# EAGLE design raspberrypi-testcard (EAGLE 7.5.0)

## Sheet 1 of 2
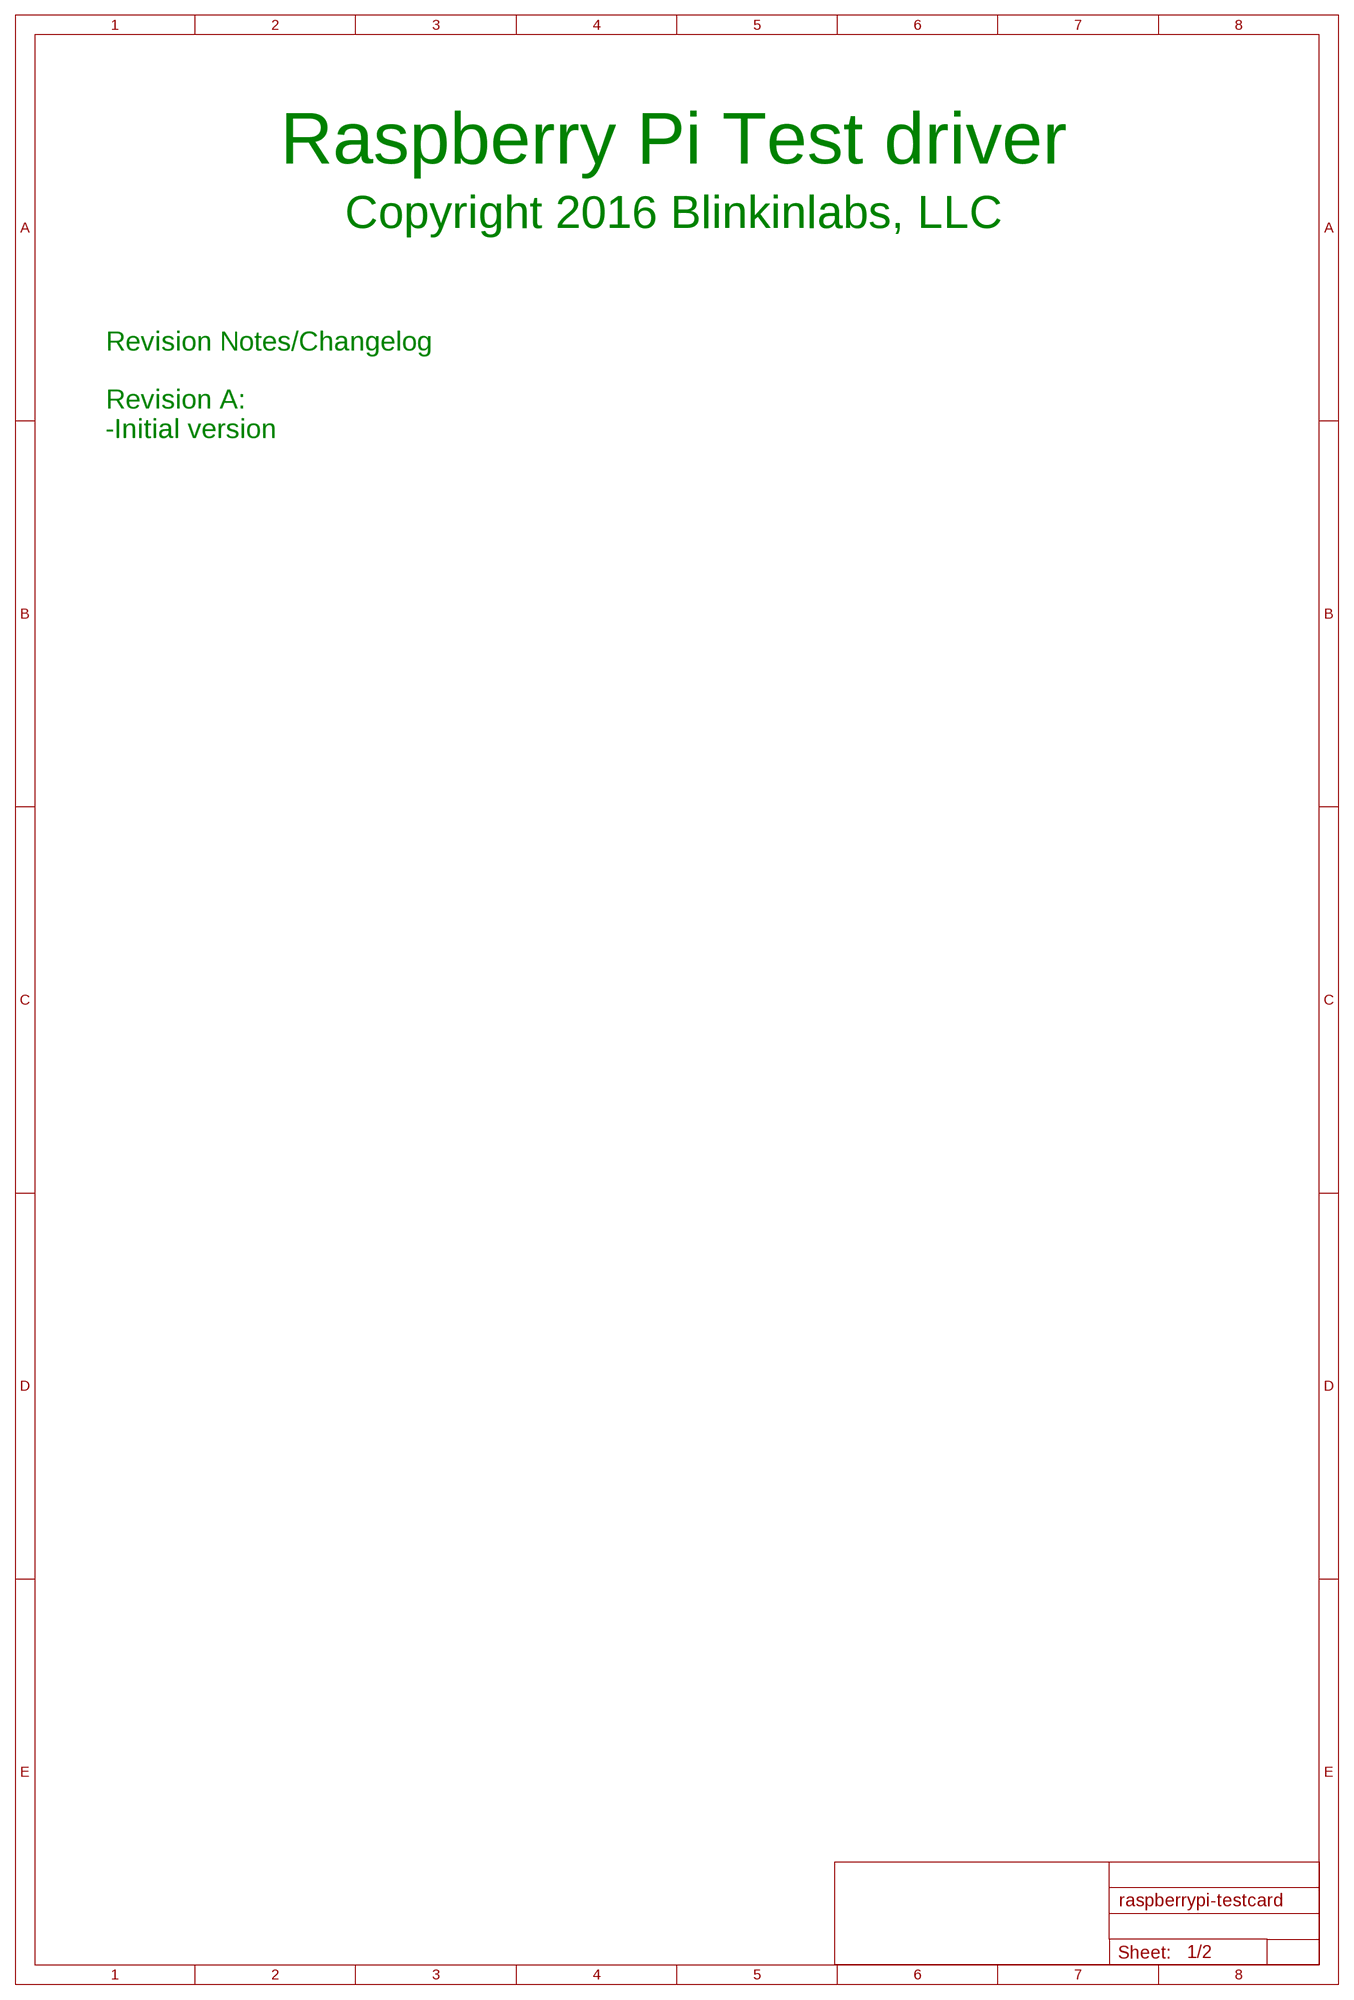
[diagram p0: schematic, sheet 1]

### Notes on the sheet
- Raspberry Pi Test driver
- Copyright 2016 Blinkinlabs, LLC
- Revision Notes/Changelog
  
  Revision A:
  -Initial version

## Sheet 2 of 2
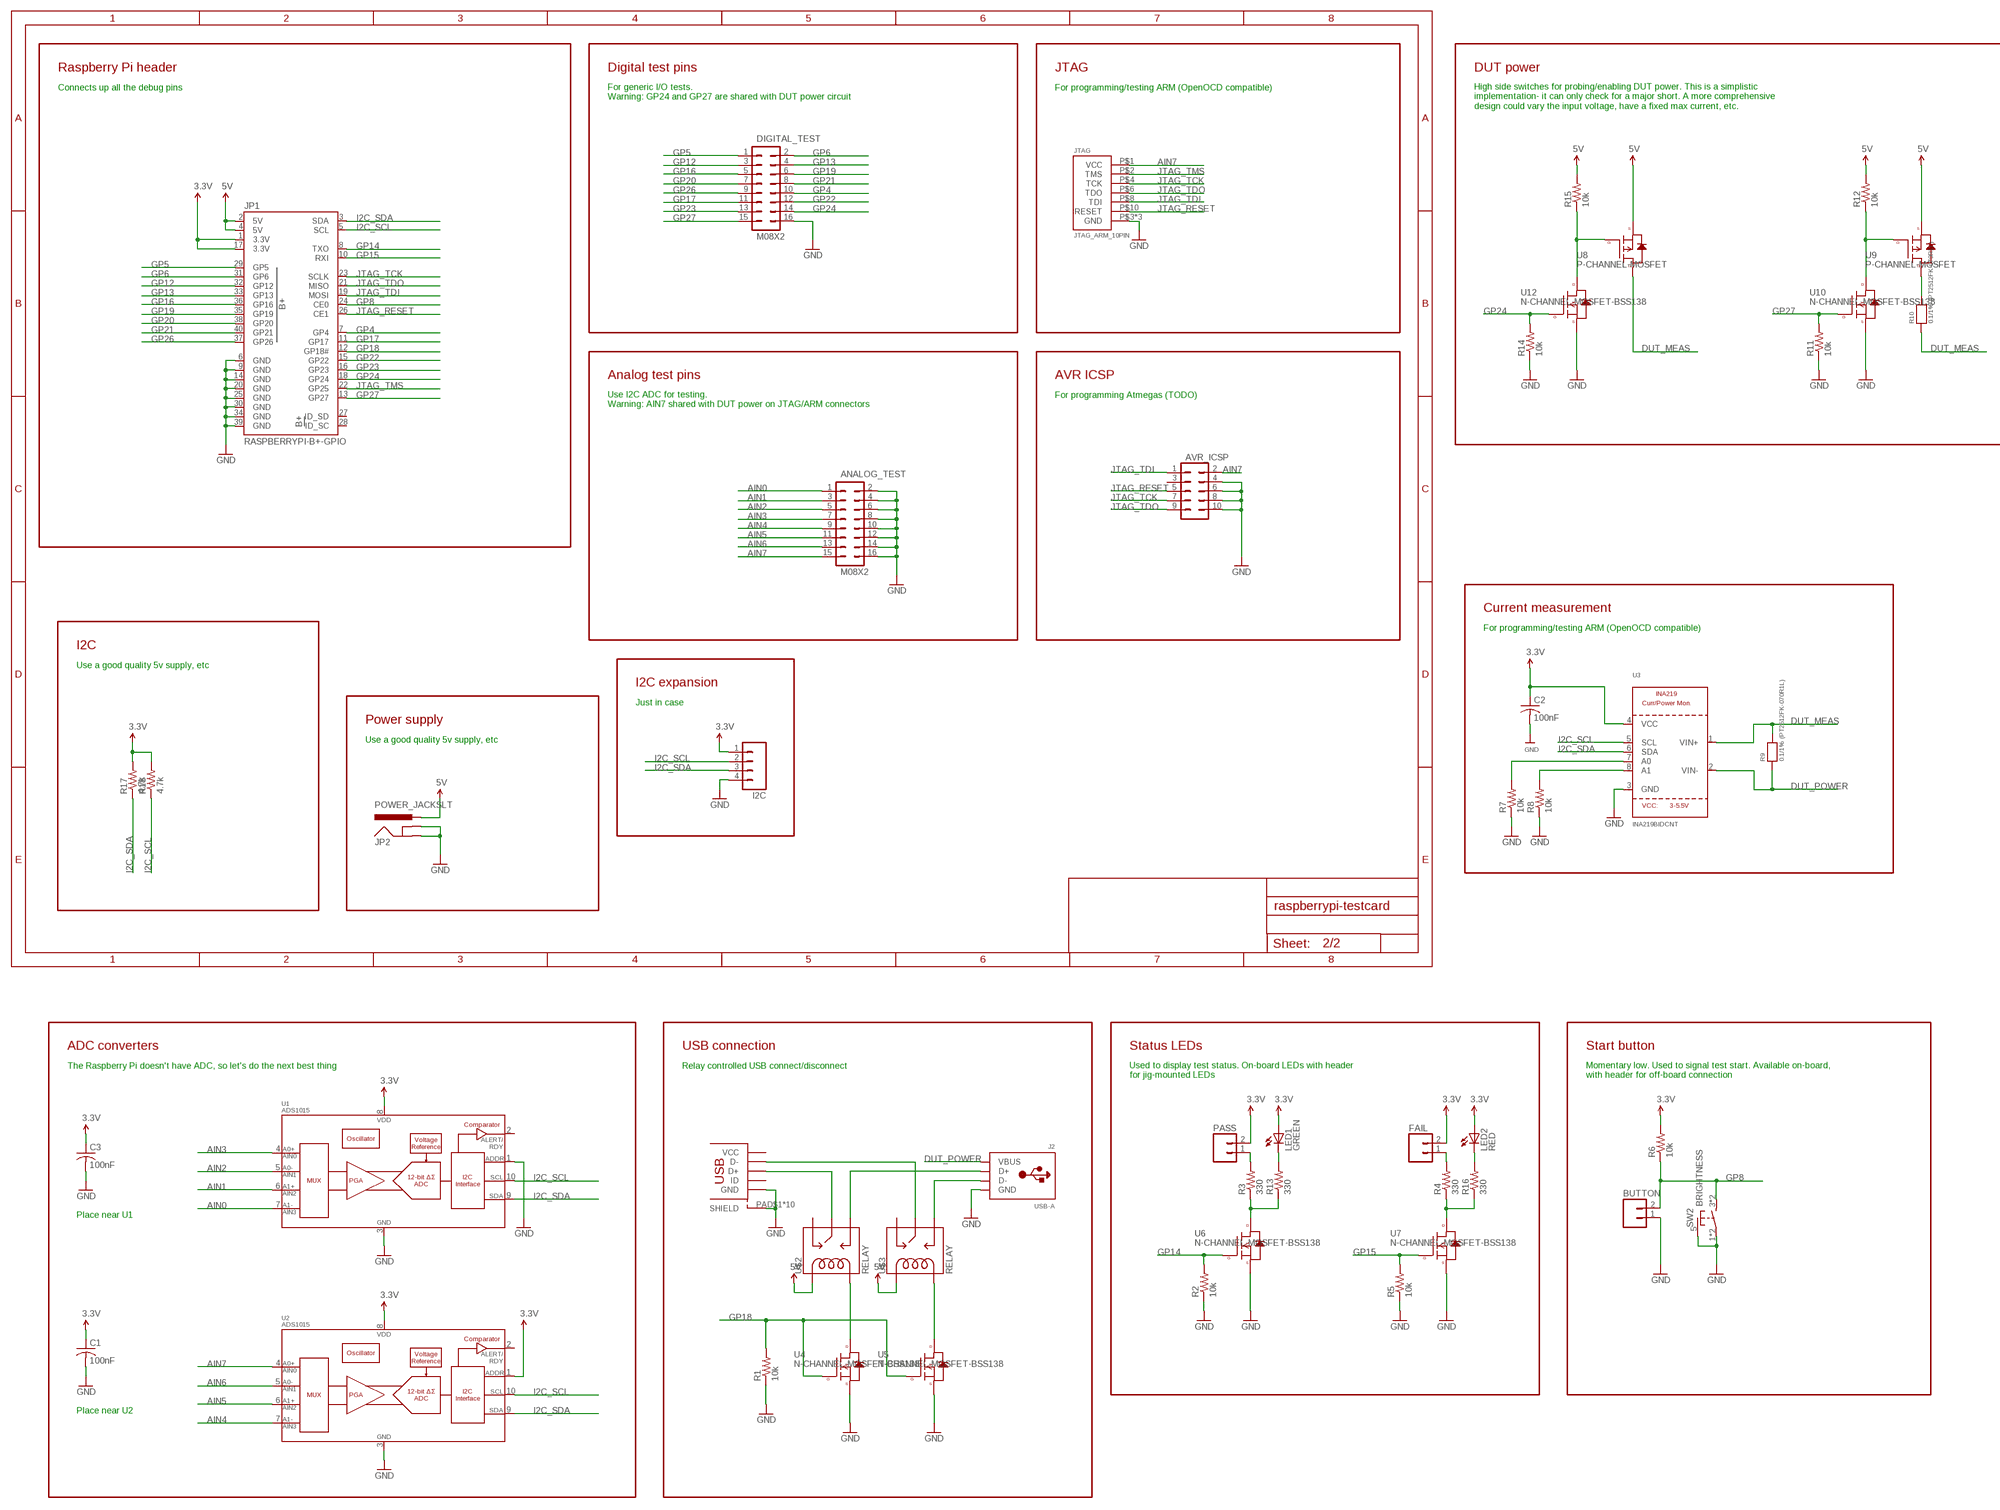
[diagram p1: schematic, sheet 2, part 1 of 2]
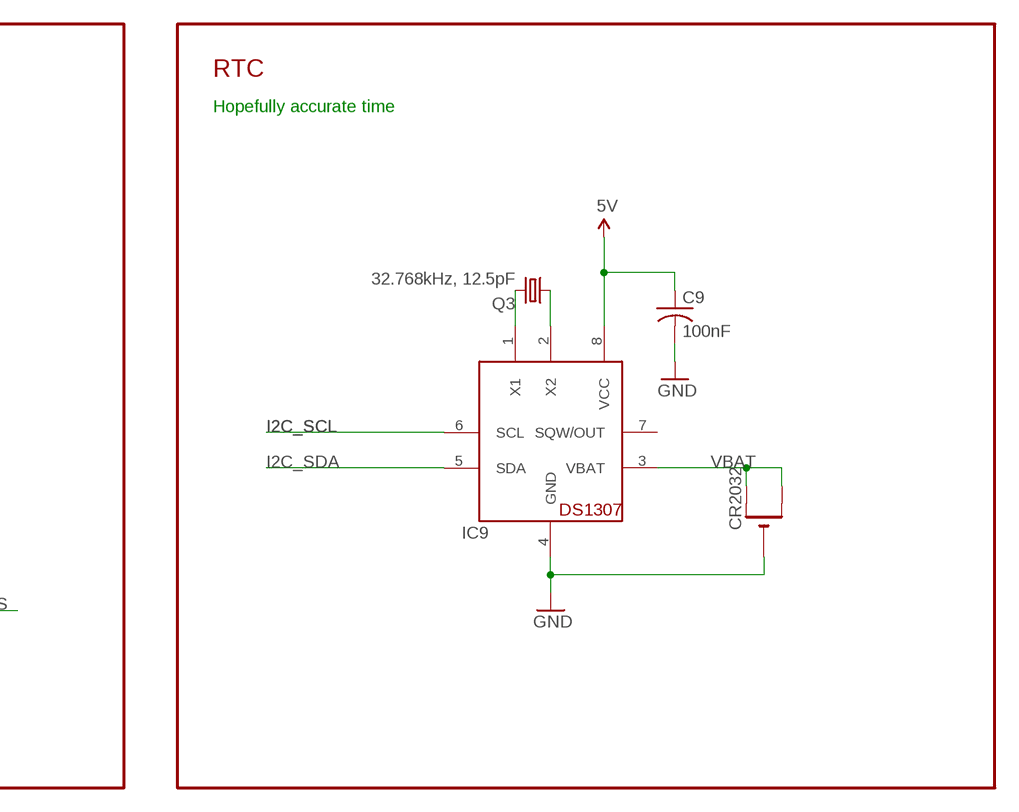
[diagram p2: schematic, sheet 2, part 2 of 2]

### Parts
ANALOG_TEST  M08X2  [2X8]
AVR_ICSP  M05X2PTH  [AVR_ICSP]
BUTTON  M02JST-PTH-2  [JST-2-PTH]
C1  100nF  C-USC0402  [C0402]
C2  100nF  C-USC0402  [C0402]
C3  100nF  C-USC0402  [C0402]
C9  100nF  C-USC0402K  [C0402K]
CR2032  CR2032SMT  [CR2032-SMD]
DIGITAL_TEST  M08X2  [2X8]
FAIL  M02JST-PTH-2  [JST-2-PTH]
I2C  M04PTH  [1X04]
IC9  DS1307SO08  [SO08-150]
J1  USB_MICROSMT+THRUHULE  [USB_MICRO_THRUHOLE]
J2  USB-A  [MOLEX_480371000]
JP1  RASPBERRYPI-B+-GPIO  [2X20-SHROUDED]
JP2  POWER_JACKSLT  [POWER_JACK_SLOT]
JTAG  JTAG_ARM_10PIN  [2X05-1.27MM-SMD]
LED1  GREEN  LEDCHIP-LED0805  [CHIP-LED0805]
LED2  RED  LEDCHIP-LED0805  [CHIP-LED0805]
PASS  M02JST-PTH-2  [JST-2-PTH]
Q3  32.768kHz, 12.5pF  CRYSTALTC26H  [TC26H]
R1  10k  R-US_R0402  [R0402]
R2  10k  R-US_R0402  [R0402]
R3  330  R-US_R0402  [R0402]
R4  330  R-US_R0402  [R0402]
R5  10k  R-US_R0402  [R0402]
R6  10k  R-US_R0402  [R0402]
R7  10k  R-US_R0402  [R0402]
R8  10k  R-US_R0402  [R0402]
R9  0.1/1% (PT2512FK-070R1L)  RESISTOR2512  [2512]
R10  0.1/1% (PT2512FK-070R1L)  RESISTOR2512  [2512]
R11  10k  R-US_R0402  [R0402]
R12  10k  R-US_R0402  [R0402]
R13  330  R-US_R0402  [R0402]
R14  10k  R-US_R0402  [R0402]
R15  10k  R-US_R0402  [R0402]
R16  330  R-US_R0402  [R0402]
R17  4.7k  R-US_R0402  [R0402]
R18  4.7k  R-US_R0402  [R0402]
SW2  BRIGHTNESS  BUTTON_MOMENTARY_GROUND  [TD-07XB]
U1  ADS1015  [MSOP10]
U2  ADS1015  [MSOP10]
U3  INA219BIDCNT  INA219  [SOT23-8]
U4  N-CHANNEL-MOSFET-BSS138  [SOT23-3]
U5  N-CHANNEL-MOSFET-BSS138  [SOT23-3]
U6  N-CHANNEL-MOSFET-BSS138  [SOT23-3]
U7  N-CHANNEL-MOSFET-BSS138  [SOT23-3]
U8  P-CHANNEL-MOSFET  [SOT23-3]
U9  P-CHANNEL-MOSFET  [SOT23-3]
U10  N-CHANNEL-MOSFET-BSS138  [SOT23-3]
U12  N-CHANNEL-MOSFET-BSS138  [SOT23-3]
U$2  RELAY  [RELAY_HK23F-5V]
U$3  RELAY  [RELAY_HK23F-5V]

### Nets
3.3V [power]: C1.1 C2.1 C3.1 FAIL.2 I2C.1 JP1.1(3.3V) JP1.17(3.3V) LED1.A LED2.A PASS.2 R6.2 R17.2 R18.2 U1.8(VDD) U2.1(ADDR) U2.8(VDD) U3.4(VCC)
5V [power]: C9.1 IC9.8(VCC) JP1.2(5V) JP1.4(5V) JP2.PWR R12.2 R15.2 U8.2(S) U9.2(S) U$2.P$2(COIL1) U$3.P$2(COIL1)
AIN0: ANALOG_TEST.1 U1.7(AIN3)
AIN1: ANALOG_TEST.3 U1.6(AIN2)
AIN2: ANALOG_TEST.5 U1.5(AIN1)
AIN3: ANALOG_TEST.7 U1.4(AIN0)
AIN4: ANALOG_TEST.9 U2.7(AIN3)
AIN5: ANALOG_TEST.11 U2.6(AIN2)
AIN6: ANALOG_TEST.13 U2.5(AIN1)
AIN7: ANALOG_TEST.15 AVR_ICSP.2 JTAG.P$1(VCC) U2.4(AIN0)
DUT_MEAS: R9.2 R10.1 U3.1(VIN+) U8.3(D)
DUT_POWER: J2.1(VBUS) R9.1 U3.2(VIN-)
GND [power]: ANALOG_TEST.2 ANALOG_TEST.4 ANALOG_TEST.6 ANALOG_TEST.8 ANALOG_TEST.10 ANALOG_TEST.12 ANALOG_TEST.14 ANALOG_TEST.16 AVR_ICSP.4 AVR_ICSP.6 AVR_ICSP.8 AVR_ICSP.10 BUTTON.1 C1.2 C2.2 C3.2 C9.2 CR2032.- DIGITAL_TEST.16 I2C.4 IC9.4(GND) J1.PAD$1(SHIELD) J1.PAD$2(SHIELD) J1.PAD$3(SHIELD) J1.PAD$4(SHIELD) J1.PAD$5(SHIELD) J1.PAD$6(SHIELD) J1.PAD$7(SHIELD) J1.PAD$8(SHIELD) J1.PAD$9(SHIELD) J1.PAD$10(SHIELD) J1.PIN$5(GND) J2.4(GND) JP1.6(GND) JP1.9(GND) JP1.14(GND) JP1.20(GND) JP1.25(GND) JP1.30(GND) JP1.34(GND) JP1.39(GND) JP2.GND@1(GNDBREAK) JP2.GND@2(GND) JTAG.P$3(GND) JTAG.P$5(GND) JTAG.P$9(GND) R1.1 R2.1 R5.1 R7.1 R8.1 R11.1 R14.1 SW2.1(P) SW2.2(P) SW2.5(SHIELD) U1.1(ADDR) U1.3(VSS) U2.3(VSS) U3.3(GND) U4.2(S) U5.2(S) U6.2(S) U7.2(S) U10.2(S) U12.2(S)
GP4: DIGITAL_TEST.10 JP1.7(GP4)
GP5: DIGITAL_TEST.1 JP1.29(GP5)
GP6: DIGITAL_TEST.2 JP1.31(GP6)
GP8: BUTTON.2 JP1.24(CE0) R6.1 SW2.3(S) SW2.4(S)
GP12: DIGITAL_TEST.3 JP1.32(GP12)
GP13: DIGITAL_TEST.4 JP1.33(GP13)
GP14: JP1.8(TXO) R2.2 U6.1(G)
GP15: JP1.10(RXI) R5.2 U7.1(G)
GP16: DIGITAL_TEST.5 JP1.36(GP16)
GP17: DIGITAL_TEST.11 JP1.11(GP17)
GP18: JP1.12(GP18#) R1.2 U4.1(G) U5.1(G)
GP19: DIGITAL_TEST.6 JP1.35(GP19)
GP20: DIGITAL_TEST.7 JP1.38(GP20)
GP21: DIGITAL_TEST.8 JP1.40(GP21)
GP22: DIGITAL_TEST.12 JP1.15(GP22)
GP23: DIGITAL_TEST.13 JP1.16(GP23)
GP24: DIGITAL_TEST.14 JP1.18(GP24) R14.2 U12.1(G)
GP26: DIGITAL_TEST.9 JP1.37(GP26)
GP27: DIGITAL_TEST.15 JP1.13(GP27) R11.2 U10.1(G)
I2C_SCL: I2C.2 IC9.6(SCL) JP1.5(SCL) R18.1 U1.10(SCL) U2.10(SCL) U3.5(SCL)
I2C_SDA: I2C.3 IC9.5(SDA) JP1.3(SDA) R17.1 U1.9(SDA) U2.9(SDA) U3.6(SDA)
JTAG_RESET: AVR_ICSP.5 JP1.26(CE1) JTAG.P$10(RESET)
JTAG_TCK: AVR_ICSP.7 JP1.23(SCLK) JTAG.P$4(TCK)
JTAG_TDI: AVR_ICSP.1 JP1.19(MOSI) JTAG.P$8(TDI)
JTAG_TDO: AVR_ICSP.9 JP1.21(MISO) JTAG.P$6(TDO)
JTAG_TMS: JP1.22(GP25) JTAG.P$2(TMS)
N$1: J1.PIN$3(D+) U$2.P$1(MAIN) U$2.P$6(MAIN)
N$2: J2.3(D+) U$2.P$3(NO)
N$3: J1.PIN$2(D-) U$3.P$1(MAIN) U$3.P$6(MAIN)
N$4: J2.2(D-) U$3.P$3(NO)
N$5 [power]: R4.1 R16.1 U7.3(D)
N$6 [power]: U5.3(D) U$3.P$5(COIL2)
N$7 [power]: U4.3(D) U$2.P$5(COIL2)
N$8 [power]: R3.1 R13.1 U6.3(D)
N$9: R8.2 U3.8(A1)
N$10 [power]: FAIL.1 R4.2
N$11 [power]: PASS.1 R3.2
N$12: R7.2 U3.7(A0)
N$13 [power]: R10.2 U9.3(D)
N$14 [power]: R12.1 U9.1(G) U10.3(D)
N$15 [power]: LED2.C R16.2
N$16 [power]: R15.1 U8.1(G) U12.3(D)
N$17 [power]: LED1.C R13.2
N$72 [power]: IC9.1(X1) Q3.2
N$73 [power]: IC9.2(X2) Q3.1
VBAT [power]: CR2032.+$1(+) CR2032.+$2(+1) IC9.3(VBAT)
Unconnected: AVR_ICSP.3 IC9.7(SQW/OUT) J1.PIN$1(VCC) J1.PIN$4(ID) JP1.27(ID_SD) JP1.28(ID_SC) U1.2(ALERT/RDY) U2.2(ALERT/RDY) U$2.P$4(NC) U$3.P$4(NC)

### Notes on the sheet
- Raspberry Pi header | Digital test pins | JTAG | DUT power | RTC
- Connects up all the debug pins | For programming/testing ARM (OpenOCD compatible) | Hopefully accurate time
- For generic I/O tests.
  Warning: GP24 and GP27 are shared with DUT power circuit
- High side switches for probing/enabling DUT power. This is a simplistic
  implementation- it can only check for a major short. A more comprehensive
  design could vary the input voltage, have a fixed max current, etc.
- Analog test pins | AVR ICSP
- For programming Atmegas (TODO)
- Use I2C ADC for testing.
  Warning: AIN7 shared with DUT power on JTAG/ARM connectors
- Current measurement
- For programming/testing ARM (OpenOCD compatible)
- I2C
- Use a good quality 5v supply, etc
- I2C expansion
- Just in case
- Power supply
- Use a good quality 5v supply, etc
- ADC converters | USB connection | Status LEDs | Start button
- The Raspberry Pi doesn't have ADC, so let's do the next best thing | Relay controlled USB connect/disconnect
- Used to display test status. On-board LEDs with header
  for jig-mounted LEDs
- Momentary low. Used to signal test start. Available on-board,
  with header for off-board connection
- Place near U1
- Place near U2

## Library data of the parts
ANALOG_TEST DIGITAL_TEST = SparkFun-Connectors:M08X2: .1" headers, two rows of 8 each
AVR_ICSP = SparkFun-Connectors:M05X2: Header 5x2 Standard 10-pin dual row 0.1" header. Commonly used with AVR-ISP. Use with Spark Fun Electronics SKU: PRT-00778
BUTTON FAIL PASS = SparkFun-Connectors:M02: Standard 2-pin 0.1" header. Use with - straight break away headers ( PRT-00116) - right angle break away headers (PRT-00553) - swiss pins (PRT-00743) - machine pins (PRT-00117) - female headers (PRT-00115) Molex polarized connector foot print use with: PRT-08233 with associated crimp pins and housings. 2.54_SCREWTERM for use with PRT-10571. 3.5mm Screw Terminal footprints for PRT-08084 5mm Screw Terminal footprints for use with PRT-08432; PROD_ID: CONN-09863; SKU: PRT-09914
C1-C3 C9 = adafruit:C-US: CAPACITOR, American symbol
CR2032 = adafruit:CR2032
I2C = SparkFun-Connectors:M04: Header 4 Standard 4-pin 0.1" header. Use with straight break away headers (SKU : PRT-00116), right angle break away headers (PRT-00553), swiss pins (PRT-00743), machine pins (PRT-00117), and female headers (PRT-00115). Molex polarized connector foot print use with SKU : PRT-08231 with associated crimp pins and housings. 1MM SMD Version SKU: PRT-10208
IC9 = blinkinlabs:DS1307: DS1307 Real time clock (RTC) with battery backup ability. Talk to it via i2c
J1 = blinkinlabs:USB_MICRO
J2 = adafruit:USB-A: USB type A 'plug' Used for things that can directly connect to a USB port, say USB key
JP1 = SparkFun-Boards:RASPBERRYPI-B+-GPIO: Raspberry Pi B+ GPIO Header 2x20 pin connector
JP2 = SparkFun-Connectors:POWER_JACK: Power Jack This is the standard 5.5mm barrel jack for power. The PTH is the most common, proven, reliable, footprint. The Slot footprint only works if the mill layer is transmitted to the PCB fab house so be warned. Mating wall wart : TOL-00298 (and others); PROD_ID: PRT-00119
JTAG = blinkinlabs:JTAG_ARM_10PIN
LED1 LED2 = adafruit:LED: LED OSRAM: - CHIPLED LG R971, LG N971, LY N971, LG Q971, LY Q971, LO R971, LY R971 LH N974, LH R974 LS Q976, LO Q976, LY Q976 LO Q996 - Hyper CHIPLED LW Q18S LB Q993, LB Q99A, LB R99A - SideLED LS A670, LO A670, LY A670, LG A670, LP A670 LB A673, LV A673, LT A673, LW A673 LH A674 LY A675 LS A676, LA A676, LO A676, LY A676, LW A676 LS A679, LY A679, LG A679 - Hyper Micro SIDELED® LS Y876, LA Y876, LO Y876, LY Y876 LT Y87S - SmartLED LW L88C, LW L88S LB L89C, LB L89S, LG L890 LS L89K, LO L89K, LY L89K LS L896, LA L896, LO L896, LY L896 - TOPLED LS T670, LO T670, LY T670, LG T670, LP T670 LSG T670, LSP T670, LSY T670, LOP T670, LYG T670 LG T671, LOG T671, LSG T671 LB T673, LV T673, LT T673, LW T673 LH T674 LS T676, LA T676, LO T676, LY T676, LB T676, LH T676, LSB T676, LW T676 LB T67C, LV T67C, LT T67C, LS T67K, LO T67K, LY T67K, LW E67C LS E67B, LA E67B, LO E67B, LY E67B, LB E67C, LV E67C, LT E67C LW T67C LS T679, LY T679, LG T679 LS T770, LO T770, LY T770, LG T770, LP T770 LB T773, LV T773, LT T773, LW T773 LH T774 LS E675, LA E675, LY E675, LS T675 LS T776, LA T776, LO T776, LY T776, LB T776 LHGB T686 LT T68C, LB T68C - Hyper Mini TOPLED® LB M676 - Mini TOPLED Santana® LG M470 LS M47K, LO M47K, LY M47K Source: http://www.osram.convergy.de/
Q3 = adafruit:CRYSTAL: CRYSTAL; OC_FARNELL: unknown; OC_NEWARK: unknown
R1-R8 R11-R18 = adafruit:R-US_: RESISTOR, American symbol
R9 R10 = microbuilder:RESISTOR: Resistors 0402 - 0402 Surface Mount Package 22 Ohm 1% 1/16W [Digikey: 311-22.0LRTR-ND] 33 Ohm 5% 1/16W 1.0K 5% 1/16W 1.5K 5% 1/16W 2.0K 1% 1/16W 10.0K 1% 1/16W [Digikey: 311-10.0KLRTR-ND] 10.0K 5% 1/16W [Digikey: RMCF0402JT10K0TR-ND] 12.1K 1% 1/16W [Digikey: 311-22.0LRTR-ND] 100.0K 5% 1/16W 0603 - 0603 Surface Mount Package 0 Ohm 1/10 Watt 1% Resistor 15 Ohm 1/10 Watt 1% Resistor 33 Ohm 1/10 Watt 1% Resistor 49.9 Ohm 1/10 Watt 1% Resistor 100 Ohm 1/10 Watt 1% Resistor 150 Ohm 1/10 Watt 1% Resistor 240 Ohm 1/10 Watt 1% Resistor 390 Ohm 1/10 Watt 1% Resistor 560 Ohm 1/10 Watt 1% Resistor 680 Ohm 1/10 Watt 1% Resistor 750 Ohm 1/10 Watt 1% Resistor 1.0K Ohm 1/10 Watt 1% Resistor 1.5K Ohm 1/10 Watt 1% Resistor 2.0K Ohm 1/10 Watt 1% Resistor 2.2K Ohm 1/10 Watt 1% Resistor 3.3K Ohm 1/10 Watt 1% Resistor 4.7K Ohm 1/10 Watt 1% Resistor 10.0K Ohm 1/10 Watt 1% Resistor 12.0K Ohm 1/10 Watt 1% Resistor 12.1K Ohm 1/10 Watt 1% Resistor 20.0K Ohm 1/10 Watt 1% Resistor 33.0K Ohm 1/10 Watt 1% Resistor 100.0K Ohm 1/10 Watt 1% Resistor 0805 - 0805 Surface Mount Package 0 Ohm 1/8 Watt 1% Resistor 33 Ohm 1/8 Watt 1% Resistor 100 Ohm 1/8 Watt 1% Resistor 150 Ohm 1/8 Watt 1% Resistor 200 Ohm 1/8 Watt 1% Resistor 240 Ohm 1/8 Watt 1% Resistor 330 Ohm 1/8 Watt 1% Resistor 390 Ohm 1/8 Watt 1% Resistor 470 Ohm 1/8 Watt 1% Resistor 1.0K Ohm 1/8 Watt 1% Resistor 1.5K Ohm 1/8 Watt 1% Resistor 2.0K Ohm 1/8 Watt 1% Resistor 4.7K Ohm 1/8 Watt 1% Resistor 5.1K Ohm 1/8 Watt 1% Resistor 5.6K Ohm 1/8 Watt 1% Resistor 10.0K Ohm 1/8 Watt 1% Resistor 22.0K Ohm 1/8 Watt 1% Resistor 33.0K Ohm 1/8 Watt 1% Resistor 100K Ohm 1/8 Watt 1% Resistor 1206 - 1206 Surface Mount Package 2012 - 2010 Surface Mount Package 0.11 Ohm 1/2 Watt 1% Resistor - Digikey: RHM.11UCT-ND
SW2 = blinkinlabs:BUTTON_MOMENTARY_GROUND
U1 U2 = SparkFun-AnalogIC:ADS1015: 12-Bit Del-Sig ADC Four single-ended inputs or two differential inputs Internal PGA I2C interface 2.0-5.5V; PROD_ID: IC-12239
U3 = microbuilder:INA219: INA219 - I2C Current/Power Monitor Voltage Range: 0-26V Accuracy: 0.5% Temperature: -40°C - 125°C
U4-U7 U10 U12 = GeekAmmo:N-CHANNEL-MOSFET: N-Channel MOSFET Mode Field Effect Transistor; DATASHEET: http://www.fairchildsemi.com/ds/BS/BSS138.pdf; DIGIKEY: BSS138TR-ND; ELEMENT14: 2323154; URL: http://au.element14.com/fairchild-semiconductor/bss138/mosfet-n-ch-50v-220ma-sot-23/dp/2323154
U8 U9 = GeekAmmo:P-CHANNEL-MOSFET: P-Channel MOSFET Mode Field Effect Transistor
U$2 U$3 = blinkinlabs:RELAY

## Net classes
1 power: width 0.254 mm, drill 0.35 mm

## Board
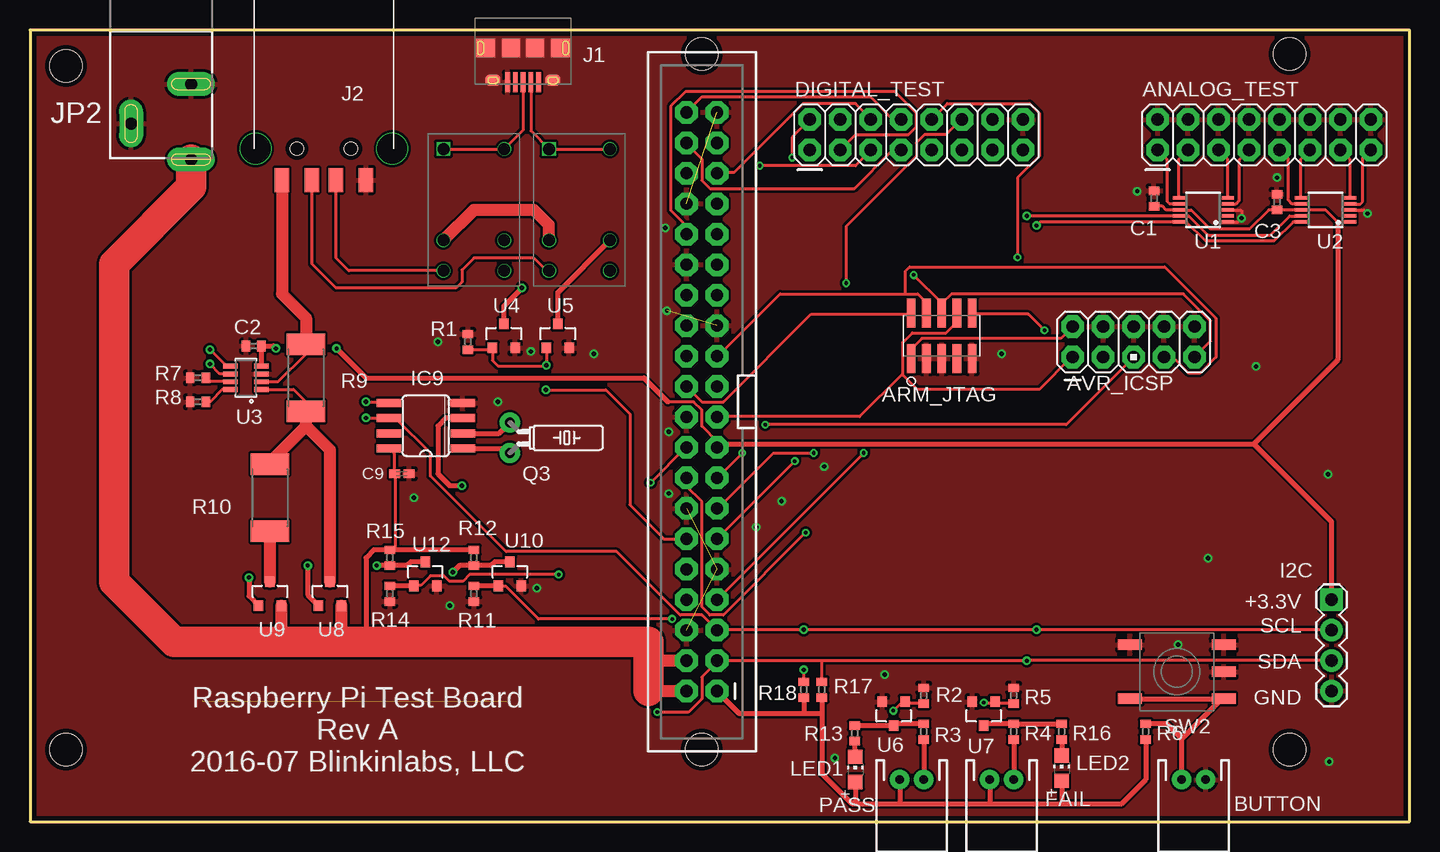
[diagram p3: board, top side]
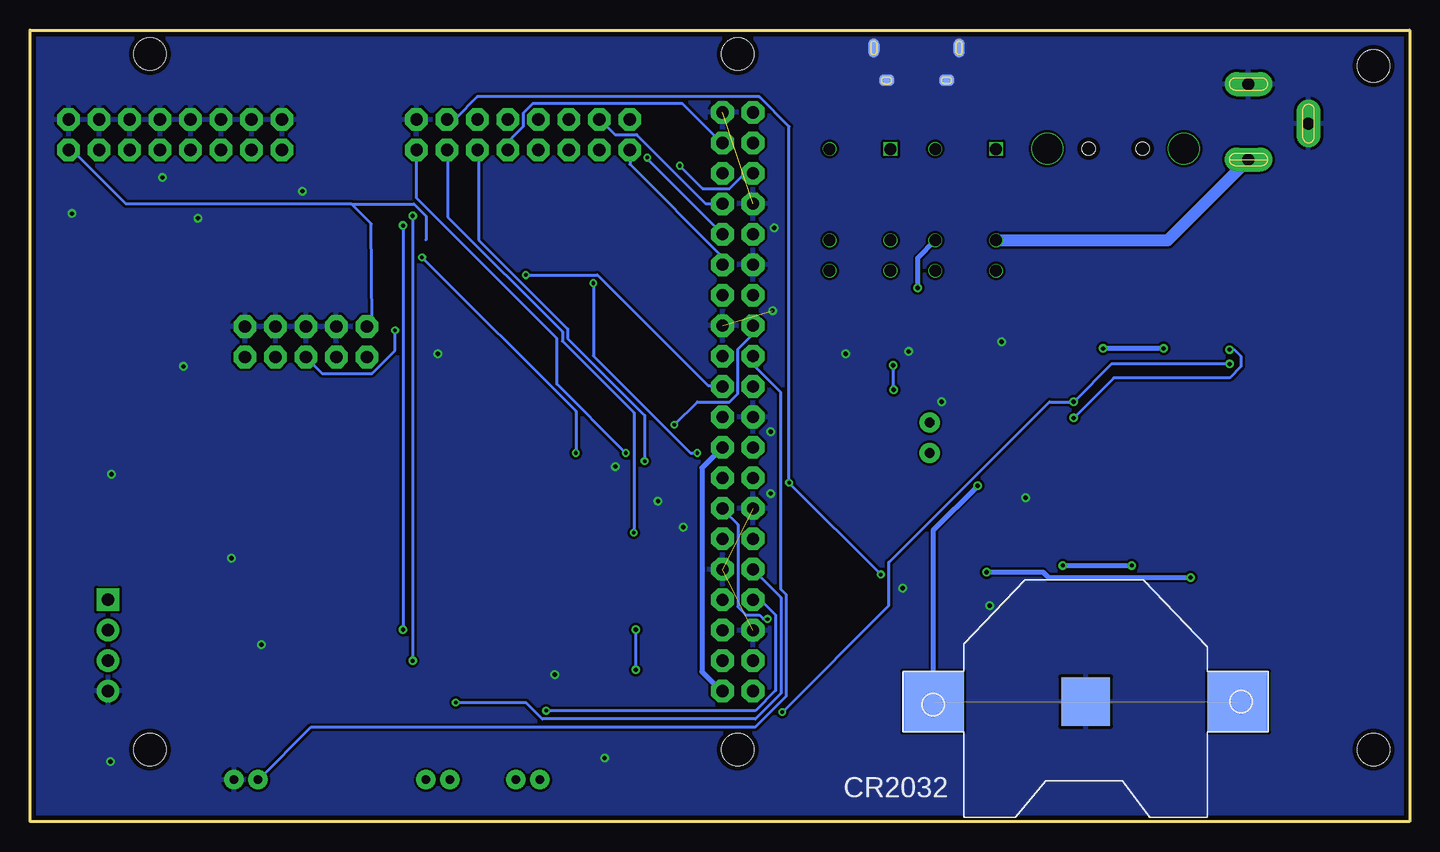
[diagram p4: board, bottom side, seen from below]

Size 115 x 66 mm. Coordinates in mm from the lower left corner, seen from the top.
Outline: 0,66 0,0 115,0 115,66 0,66
Copper layers (1*16): Top 0.0356mm / dielectric 0.6mm / Bottom 0.0356mm
Design rules "BlinkyTape *": minimum track width 0.25mm, minimum drill 0.3mm, track to track 0.2mm, track to pad 0.2mm, pad to pad 0.2mm, via to via 0.2mm, smd to smd 0.2mm, copper to edge 15mil, drill to drill 0.25mm, minimum pad ring 3mil, minimum via ring 7mil, stop-mask expansion 2mil, vias tented up to drill 0.35mm, thermal gap 10mil
Holes 2.7 mm at 56,64 56,6 105,6 105,64 3,63 3,6

### Footprints (pad centres in the part's own frame; a part is rotated, then mirrored left to right if it is on the bottom)
2X8 = drill 1.016 pad 1.88 octagon: 1 0,0; 2 0,2.54; 3 2.54,0; 4 2.54,2.54; 5 5.08,0; 6 5.08,2.54; 7 7.62,0; 8 7.62,2.54; 9 10.16,0; 10 10.16,2.54; 11 12.7,0; 12 12.7,2.54; 13 15.24,0; 14 15.24,2.54; 15 17.78,0; 16 17.78,2.54
AVR_ICSP = drill 1.016 pad 1.88 octagon: 1 -1.27,5.08; 2 1.27,5.08; 3 -1.27,2.54; 4 1.27,2.54; 5 -1.27,0; 6 1.27,0; 7 -1.27,-2.54; 8 1.27,-2.54; 9 -1.27,-5.08; 10 1.27,-5.08
JST-2-PTH = drill 0.7 pad 1.6: 1 -1,0; 2 1,0
C0402 = smd 0.7 x 0.9: 1 -0.65,0; 2 0.65,0
C0402K = smd 0.925 x 0.74: 1 -0.6,0; 2 0.6,0
CR2032-SMD = smd 5.08 x 5.08: +$1 -12.7,0; +$2 12.7,0 | smd 4.064 x 4.064: - 0,0
1X04 = drill 1.016 pad 1.88 square: 1 0,0 | drill 1.016 pad 1.88: 2 2.54,0; 3 5.08,0; 4 7.62,0
SO08-150 = smd 0.66 x 2.032: 1 -1.905,-3.073; 2 -0.635,-3.073; 3 0.635,-3.073; 4 1.905,-3.073; 5 1.905,3.073; 6 0.635,3.073; 7 -0.635,3.073; 8 -1.905,3.073
USB_MICRO_THRUHOLE = smd 1.645 x 1.55: PAD$1 -3.172,0; PAD$4 3.172,0 | smd 1.5 x 1.55: PAD$2 -1,0; PAD$3 1,0 | smd 1.25 x 0.95: PAD$5 -2.5,2.7; PAD$6 2.5,2.7 | smd 0.9 x 1.55 bottom: PAD$7 -3.55,0; PAD$8 3.55,0 | smd 1.25 x 0.95 bottom: PAD$9 -2.5,2.7; PAD$10 2.5,2.7 | smd 0.4 x 1.65: PIN$1 -1.3,2.85; PIN$2 -0.65,2.85; PIN$3 0,2.85; PIN$4 0.65,2.85; PIN$5 1.3,2.85
MOLEX_480371000 = smd 1.2 x 2: 1 3.5,2.6; 2 1,2.6; 3 -1,2.6; 4 -3.5,2.6 | drill 2.5: M1 -5.7,0; M2 5.7,0 | hole 1.1: -2.25,0; 2.25,0
2X20-SHROUDED = drill 1.016 pad 1.88 octagon: 1 -1.27,24.13; 2 1.27,24.13; 3 -1.27,21.59; 4 1.27,21.59; 5 -1.27,19.05; 6 1.27,19.05; 7 -1.27,16.51; 8 1.27,16.51; 9 -1.27,13.97; 10 1.27,13.97; 11 -1.27,11.43; 12 1.27,11.43; 13 -1.27,8.89; 14 1.27,8.89; 15 -1.27,6.35; 16 1.27,6.35; 17 -1.27,3.81; 18 1.27,3.81; 19 -1.27,1.27; 20 1.27,1.27; 21 -1.27,-1.27; 22 1.27,-1.27; 23 -1.27,-3.81; 24 1.27,-3.81; 25 -1.27,-6.35; 26 1.27,-6.35; 27 -1.27,-8.89; 28 1.27,-8.89; 29 -1.27,-11.43; 30 1.27,-11.43; 31 -1.27,-13.97; 32 1.27,-13.97; 33 -1.27,-16.51; 34 1.27,-16.51; 35 -1.27,-19.05; 36 1.27,-19.05; 37 -1.27,-21.59; 38 1.27,-21.59; 39 -1.27,-24.13; 40 1.27,-24.13
POWER_JACK_SLOT = drill 1 pad 2 long: GND@1 2.58,7.5; GND@2 7.58,10.8; PWR 2.58,13.8
2X05-1.27MM-SMD = smd 0.74 x 2.4: P$1 2.54,1.905; P$2 2.54,-1.905; P$3 1.27,1.905; P$4 1.27,-1.905; P$5 0,1.905; P$6 0,-1.905; P$7 -1.27,1.905; P$8 -1.27,-1.905; P$9 -2.54,1.905; P$10 -2.54,-1.905
CHIP-LED0805 = smd 1.2 x 1.2: A 0,-1.05; C 0,1.05
TC26H = drill 0.813 pad 1.676: 1 -1.27,0; 2 1.27,0
R0402 = smd 0.7 x 0.9: 1 -0.65,0; 2 0.65,0
2512 = smd 1.8 x 3.2: 1 -2.8,0; 2 2.8,0
TD-07XB = smd 2 x 0.9: 1 -3.9,-2.25; 2 3.9,-2.25; 3 -3.9,2.25; 4 3.9,2.25; 5 -3.9,0
MSOP10 = smd 0.3 x 1: 1 -1,-2.05; 2 -0.5,-2.05; 3 0,-2.05; 4 0.5,-2.05; 5 1,-2.05; 6 1,2.05; 7 0.5,2.05; 8 0,2.05; 9 -0.5,2.05; 10 -1,2.05
SOT23-8 = smd 0.4 x 1.2: 1 -0.975,-1.3; 2 -0.325,-1.3; 3 0.325,-1.3; 4 0.975,-1.3; 5 0.975,1.3; 6 0.325,1.3; 7 -0.325,1.3; 8 -0.975,1.3
SOT23-3 = smd 0.8 x 0.9: 1 -0.95,-1; 2 0.95,-1; 3 0,1
RELAY_HK23F-5V = drill 1 square: P$1 5.08,2.54 | drill 1: P$2 -2.54,2.54; P$3 -5.08,2.54; P$4 -5.08,-2.54; P$5 -2.54,-2.54; P$6 5.08,-2.54

### Placement (x,y rotation side)
ANALOG_TEST  94,56 0 top
AVR_ICSP  92,40 90 top
BUTTON  97,3.5 180 top
C1  93.7,51.95 90 top
C2  18.65,39.65 180 top
C3  103.95,51.65 90 top
C9  31,29 0 top
CR2032  27,10 180 bottom
DIGITAL_TEST  65,56 0 top
FAIL  81,3.5 180 top
I2C  108.5,18.5 270 top
IC9  33,33 90 top
J1  41.1,64.5 180 top
J2  24.5,56.1 180 top
JP1  56,35 180 top
JP2  16,69 180 top
JTAG  76,40.5 180 top
LED1  68.8,4.35 0 top
LED2  86,4.45 0 top
PASS  73.5,3.5 180 top
Q3  40,32 270 top
R1  36.5,40 270 top
R2  74.5,10.5 270 top
R3  74.5,7.5 270 top
R4  82,7.5 270 top
R5  82,10.5 270 top
R6  93,7.5 270 top
R7  14,37 0 top
R8  14,35 0 top
R9  23,37 270 top
R10  20,27 270 top
R11  37,19 90 top
R12  37,22 90 top
R13  68.75,7.35 270 top
R14  30,19 90 top
R15  30,22 90 top
R16  86,7.5 270 top
R17  66,11 270 top
R18  64.5,11 270 top
SW2  95.6,12.5 180 top
U1  97.8,51 90 top
U2  108,51 90 top
U3  18,37 90 top
U4  39.5,40.5 0 top
U5  44,40.5 0 top
U6  72,9 180 top
U7  79.5,9 180 top
U8  25,19 0 top
U9  20,19 0 top
U10  40,20.65 0 top
U12  32.95,20.65 0 top
U$2  37,51 90 top
U$3  45.8,51 90 top

### Tracks (layer width: path | path; a pad name or v marks a point on that pad's centre or on a via)
3.3V  (via drill 0.35)
  Top 0.254: U2.1 109,50 108,51 U2.8 C3.1 103.25,51 101.65,49.4 98.4,49.4 96.8,51 U1.8 94.7,51 94.4,51.3 C1.1 | 53.2,35 55.33,35 56,34.33 56,32.98 57.35,31.62 JP1.17
  Top 0.406: 102,31.5 57.5,31.5 JP1.17 | 69,1.5 68.5,1.5 66,4 66,9 | 69,1.5 72.55,1.5 | 72.55,1.5 80,1.5 | 80,1.5 86,1.5 | 86,1.5 91,1.5 93,3.5 R6.2 | FAIL.2 80,1.5 | 66,9 64.5,9 | 64.5,9 59.14,9 JP1.1 | R17.2 66,9 | R18.2 64.5,9 | v20.5,39.45 20.3,39.65 C2.1 U3.4 | v25.55,39.45 28,37 51.2,37 53.2,35 | 68.8,3.35 LED1.A 68.8,1.7 69,1.5 | LED2.A 86,1.5 | PASS.2 72.5,1.55 72.55,1.5 | 109,50 109,38.5 102,31.5 | I2C.1 108.5,25 102,31.5
  Bottom 0.406: JP1.1 57.5,11 59,12.5 59,29.5 57.5,31 JP1.17 | v20.5,39.45 v25.55,39.45
5V
  Top 0.254: IC9.8 30.01,31.06 30.35,30.73 30.35,29.04 C9.1 30.46,28.93 30.46,22.65
  Top 0.406: 28,15 28,22 28.65,22.65 R15.2 30.46,22.65 R12.2
  Top 1.016: JP1.4 51.59,13.41 51.55,13.45 | JP1.2 51.68,10.87 51.55,11 | U9.2 20.95,15.05 21,15 | U8.2 25.95,15.05 26,15 | U$3.P$2 43.26,49.74 42,51 37,51 U$2.P$2
  Top 2.54: JP2.PWR 13.42,52.92 7,46.5 7,20 12,15 21,15 26,15 28,15 51.55,15 51.55,13.45 51.55,11 51.55,10.9
  Bottom 1.016: U$2.P$2 20.16,48.46 JP2.PWR
AIN0
  Top 0.254: U1.7 95,51.5 94.8,51.7 94.8,55.2 ANALOG_TEST.1
AIN1
  Top 0.254: U1.6 95.75,55.21 ANALOG_TEST.3
AIN2
  Top 0.254: U1.5 99.85,55.23 ANALOG_TEST.5
AIN3
  Top 0.254: U1.4 100.5,51.5 100.8,51.8 100.8,55.18 ANALOG_TEST.7
AIN4
  Top 0.254: U2.7 105.2,51.5 104.9,51.8 104.9,55.26 ANALOG_TEST.9
AIN5
  Top 0.254: U2.6 105.95,55.25 ANALOG_TEST.11
AIN6
  Top 0.254: U2.5 110.05,55.19 ANALOG_TEST.13
AIN7
  Top 0.25: JTAG.P$1 73.55,38.6 73.55,39.5 74.34,40.29 85.92,40.29 86.83,41.19 AVR_ICSP.2
  Top 0.254: U2.4 110.9,51.5 111.1,51.7 111.1,55.32 ANALOG_TEST.15
  Bottom 0.25: 82,48.5 82,50.5 83,51.5 88.2,51.5 | 88.2,51.5 86.55,49.85 86.5,41.5 AVR_ICSP.2 | 88.2,51.5 93.5,51.5 107,51.5 111.5,56 ANALOG_TEST.15
DUT_MEAS
  Top 0.254: U3.1 21.98,36.02 23,35 R9.2
  Top 1.016: R10.1 20,30 23,33 | 23,33 R9.2 | U8.3 25,31 23,33
DUT_POWER
  Top 0.254: U3.2 20.67,36.67 23,39 R9.1
  Top 1.016: J2.1 21,44 23,42 R9.1
GND  (via drill 0.35)  (4 unrouted)
  Top 0.254: U2.3 111.2,51 | U1.1 100.7,50 v101,50.3 101,50.9 100.9,51 U1.3
  Bottom 0.254: v101,50.3 101,50.6
  other vias: 103.95,53.7 92.3,52.55 111.5,50.7 34,40 47,39 39,35 32,27 41.75,39.2 35,18 66.2,29.6 81,39 52.95,49.5 53.1,42.6 42.25,19.45 62.65,26.7 60.55,24.55 108.2,28.95 108.3,5 53.25,27.35 53.25,32.5 71.25,12.25 67.1,5.3 95.7,14.75 98.2,21.95 102.2,37.95
  pour Bottom: 0,66 115,66 115,0 0,0
  pour Top: 0,0 115,0 115,66 0,66
GP4  (via drill 0.3)
  Top 0.25: v69.5,30.73 57.35,18.57 JP1.7 | v82.33,47.04 82.33,53.67 84.12,55.48 84.12,59.08 83.34,59.86 76.47,59.86 75.24,58.62 DIGITAL_TEST.10
  Bottom 0.25: v69.5,30.73 69.5,34.21 v82.33,47.04
GP5
  Bottom 0.25: DIGITAL_TEST.1 65,54.8 57.35,47.15 57.35,46.48 JP1.29
GP6  (via drill 0.3)
  Top 0.25: v63.54,55.36 63.54,57.05 65,58.51 DIGITAL_TEST.2
  Bottom 0.25: v63.54,55.36 63.54,55.25 57.35,49.06 JP1.31
GP8
  Top 0.406: BUTTON.2 96,6.9 | 96,6.9 94.75,8.15 R6.1 | 96,6.9 99.35,10.25 SW2.3 SW2.4
  Bottom 0.25: JP1.24 54.65,38.71 54.65,38.04 52.4,35.79 52.4,19.36 51.95,18.91 51.95,10.48 54.54,7.89 91.55,7.89 95.94,3.5 BUTTON.2
GP12
  Top 0.25: JP1.32 54.65,49.06 54.65,49.74 53.41,50.98 53.41,59.64 54.65,60.88 72.09,60.88 73.89,59.08 73.89,57.95 73.21,57.27 68.83,57.27 67.59,56.04 DIGITAL_TEST.3
GP13
  Bottom 0.25: JP1.33 57.35,51.54 58.7,51.54 64.44,57.27 66.24,57.27 67.47,58.51 DIGITAL_TEST.4
GP14  (via drill 0.3)
  Top 0.25: v71.97,9.24 72.65,9.91 72.88,9.91 U6.1
  Top 0.254: R2.2 73.1,9.85 U6.1
  Bottom 0.25: v71.97,9.24 54.54,9.24 52.85,10.93 52.85,17.23 54.09,18.46 54.65,18.46 JP1.8
GP15  (via drill 0.3)
  Top 0.25: v79.51,9.91 80.41,9.91 U7.1
  Top 0.254: R5.2 80.6,9.85 U7.1
  Bottom 0.25: v79.51,9.91 73.66,9.91 72.31,8.56 54.54,8.56 52.4,10.7 52.4,18.69 54.65,20.94 JP1.10
GP16  (via drill 0.3)
  Top 0.25: v60.84,54.69 68.83,54.69 70.06,55.92 DIGITAL_TEST.5
  Bottom 0.25: v60.84,54.69 58.92,52.77 56.67,52.77 55.44,54.01 54.76,54.01 JP1.36
GP17  (via drill 0.3)
  Top 0.25: v63.76,30.05 57.35,23.64 JP1.11
  Bottom 0.25: v63.76,30.05 63.76,33.88 70.17,40.29 70.17,41.08 77.6,48.5 77.6,55.92 DIGITAL_TEST.11
GP18  (via drill 0.35)
  Top 0.254: R1.2 38.4,39.35 U4.1 38.55,38.45 39,38 43,38 v43.05,38.05 U5.1 | v43,36 48,36 50,34 50,26.4 52.85,23.55 54.71,23.55 JP1.12
  Bottom 0.254: v43.05,38.05 43.05,36.05 v43,36
GP19
  Top 0.25: JP1.35 57.35,54.12 58.7,54.12 64.44,59.86 68.83,59.86 70.06,58.62 DIGITAL_TEST.6
GP20
  Top 0.25: DIGITAL_TEST.7 72.54,55.92 71.86,55.92 68.71,52.77 56.67,52.77 56,53.45 56,55.25 54.76,56.49 JP1.38
GP21
  Top 0.25: DIGITAL_TEST.8 72.54,58.62 71.86,58.62 70.06,60.42 56,60.42 54.76,59.19 JP1.40
GP22  (via drill 0.3)
  Top 0.25: v59.38,30.73 57.35,28.7 JP1.15 | v68.04,44.9 68.04,49.62 73.89,55.48 73.89,56.6 74.56,57.27 76.36,57.27 77.6,58.51 DIGITAL_TEST.12
  Bottom 0.25: v59.38,30.73 59.94,30.73 68.04,38.83 v68.04,44.9
GP23  (via drill 0.3)
  Top 0.25: v64.66,24.09 57.8,17.23 56.67,17.23 56,17.9 56,26.68 54.76,27.91 54.76,28.59 JP1.16
  Bottom 0.25: v64.66,24.09 64.66,34.1 70.62,40.06 70.62,40.85 80.19,50.41 80.19,55.92 DIGITAL_TEST.13
GP24  (via drill 0.3)
  Top 0.25: v44.08,20.6 36.65,20.6 36.09,20.04 34.96,20.04 34.51,20.49 33.39,20.49 32.6,19.7 32.15,19.7 U12.1 | v51.73,28.25 54.65,31.18 JP1.18
  Top 0.406: U12.1 R14.2
  Bottom 0.25: v44.08,20.6 v51.73,28.25 51.73,57.95 54.2,60.42 77.71,60.42 79.51,58.62 80.19,58.62 DIGITAL_TEST.14
GP26
  Bottom 0.25: DIGITAL_TEST.9 75.12,56.04 75.12,56.71 73.89,57.95 73.89,59.08 73.1,59.86 60.61,59.86 57.35,56.6 JP1.37
GP27  (via drill 0.3)
  Top 0.25: v53.52,16.89 42.39,16.89 39.69,19.59 39.24,19.59 U10.1 | v65.34,30.73 61.96,30.73 57.35,26.11 JP1.13
  Top 0.406: U10.1 R11.2
  Bottom 0.25: v53.52,16.89 53.86,16.89 54.2,17.23 55.33,17.23 56,17.9 56,24.76 57.24,26 JP1.13 | v65.34,30.73 71.08,36.46 71.08,40.29 82.78,51.99 82.78,55.92 DIGITAL_TEST.15
I2C_SCL  (via drill 0.35)
  Top 0.25: IC9.6 30.01,33.54 30.57,33.54 33.39,30.73 33.39,28.81 39.69,22.51 48.91,22.51 54.2,17.23 56,17.23 57.24,15.99 JP1.5
  Top 0.254: U2.10 105.3,50 103.7,48.4 98,48.4 96.4,50 U1.10 84.2,50 v83.9,49.7 | JP1.5 57.32,16 v64.5,16 v83.9,16 83.94,15.96 I2C.2 | R18.1 v64.5,12.65 | U3.5 16.38,37.98 v15,39.35 | v28,33.65 29.91,33.65 IC9.6
  Bottom 0.254: v83.9,49.7 v83.9,16 | v64.5,12.65 v64.5,16 | v15,39.35 14.6,39.35 14.05,38.8 14.05,37.95 15,37 24.65,37 v28,33.65
I2C_SDA  (via drill 0.3, 0.35)
  Top 0.25: 83,13.5 v83.1,13.4 | v52.29,9.12 54.88,9.12 56,10.25 56,12.05 57.24,13.29 JP1.3
  Top 0.254: U2.9 105,50.5 103.4,48.9 98.2,48.9 96.6,50.5 U1.9 v83.1,50.5 | 66,13.4 v83.1,13.4 83.12,13.42 I2C.3 | 66,13.4 JP1.3 | R17.1 66,13.4 | U3.6 15.83,37.33 v15,38.15 | v28,35 29.83,35 IC9.5
  Bottom 0.25: v28,35 30.01,35 43.4,21.61 43.4,18.01 v52.29,9.12
  Bottom 0.254: v83.1,50.5 v83.1,13.4 | v15,38.15 24.85,38.15 v28,35
JTAG_RESET  (via drill 0.3)
  Top 0.25: v84.58,40.96 83.22,42.31 78.61,42.31 JTAG.P$10 | v61.29,33.09 86.38,33.09 92,38.71 AVR_ICSP.5
  Bottom 0.25: v84.58,40.96 84.58,39.27 86.49,37.36 90.65,37.36 92,38.71 AVR_ICSP.5 | v61.29,33.09 59.38,35 56.67,35 56,35.67 56,39.39 54.76,40.62 54.76,41.3 JP1.26
JTAG_TCK
  Top 0.25: 72.99,44 62.52,44 57.35,38.83 JP1.23 | 72.99,44 74,44 74.67,43.33 74.67,42.42 JTAG.P$4 | 72.99,44 72.99,45.91 73.33,46.25 94.59,46.25 98.86,41.98 98.86,38.71 97.51,37.36 96.61,37.36 95.26,38.71 94.59,38.71 AVR_ICSP.7
JTAG_TDI
  Top 0.25: 72.76,37.25 72.76,39.95 73.55,40.74 76.36,40.74 77.26,41.64 77.26,42.31 JTAG.P$8 | 72.76,37.25 73.99,36.02 84.14,36.02 86.83,38.71 AVR_ICSP.1 | JP1.19 57.35,33.76 69.16,33.76 72.65,37.25 72.76,37.25
JTAG_TDO  (via drill 0.3)
  Top 0.25: 76.03,43.21 76.03,42.42 JTAG.P$6 76.03,43.21 | 76.03,43.21 76.81,44 96.16,44 98.41,41.75 98.41,40.06 AVR_ICSP.9 | 76.03,43.21 v73.66,45.58
  Bottom 0.25: v73.66,45.58 67.7,45.58 58.48,36.35 57.35,36.35 JP1.21
JTAG_TMS
  Top 0.25: JP1.22 56,35 57.8,35 65.11,42.31 73.44,42.31 JTAG.P$2
N$1
  Top 0.254: J1.PIN$3 41.1,57.64 U$2.P$6 U$2.P$1
N$2
  Top 0.254: U$2.P$3 26.58,45.92 25.5,47 J2.3
N$3
  Top 0.254: J1.PIN$2 41.75,57.59 U$3.P$1 U$3.P$6
N$4
  Top 0.254: U$3.P$3 43.08,45.92 42,47 37,47 36,46 36,45 35.5,44.5 25.5,44.5 23.5,46.5 J2.2
N$5
  Top 0.406: U7.3 79.65,8.15 R4.1 R16.1
N$6
  Top 0.406: U5.3 44,44.12 U$3.P$5
N$7  (via drill 0.35)
  Top 0.406: U4.3 39.5,43 v41,44.5
  Bottom 0.406: v41,44.5 41,47 U$2.P$5
N$8
  Top 0.406: R3.1 72.15,8.15 U6.3 R13.1
N$9
  Top 0.254: U3.8 16.02,36.02 15,35 R8.2
N$10
  Top 0.406: R4.2 FAIL.1
N$11
  Top 0.406: R3.2 PASS.1
N$12
  Top 0.254: U3.7 14.98,36.67 R7.2
N$13
  Top 1.016: U9.3 R10.2
N$14  (via drill 0.35)
  Top 0.406: U10.3 38.75,21.65 38.45,21.35 R12.1 35.8,21.35 v35.25,20.8 | v18.25,20.35 18.25,18.8 U9.1
  Bottom 0.406: v35.25,20.8 30.55,20.8 30.1,20.35 v18.25,20.35
N$15
  Top 0.406: R16.2 LED2.C
N$16  (via drill 0.35)
  Top 0.406: U12.3 31.75,21.65 31.45,21.35 R15.1 v28.9,21.35 | v23.15,21.35 23.15,18.9 U8.1
  Bottom 0.406: v28.9,21.35 v23.15,21.35
N$17
  Top 0.406: LED1.C R13.2
N$72
  Top 0.406: IC9.1 39.64,31.09 Q3.2
N$73
  Top 0.406: IC9.2 39.09,32.37 Q3.1
VBAT  (via drill 0.35)  (1 unrouted)
  Top 0.406: IC9.3 34.64,33.63 34,33 34,29 35,28 v36,28
  Bottom 0.254: 14.38,10.02 CR2032.+$1
  Bottom 0.406: CR2032.+$2 39.7,24.3 v36,28

### Text on the board
tNames: ARM_JTAG | +3.3V | SCL | SDA | GND | Raspberry Pi Test Board / Rev A / 2016-07 Blinkinlabs, LLC